# Altium schematic sheet manette_temp.SchDoc
size A4
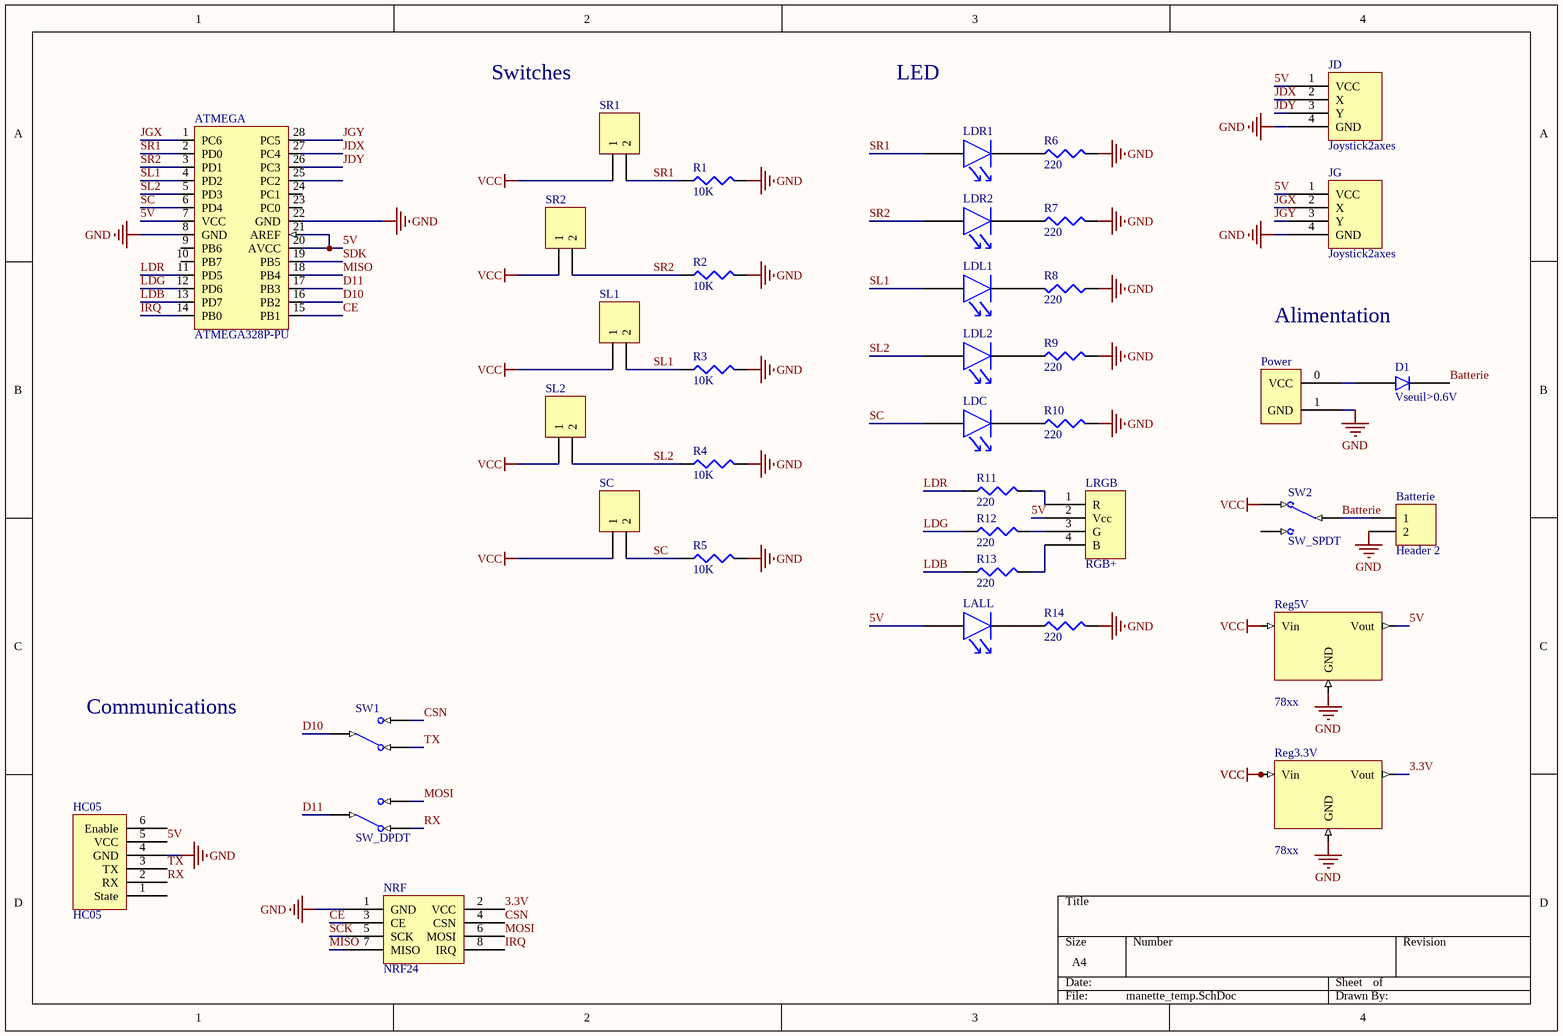
[diagram p0: manette_temp.SchDoc]

## Parts
ATMEGA  ATMEGA328P-PU  [DIP28_300]
Batterie  Header 2  [HDR1X2]
D1  Vseuil>0.6V  [SMA]
HC05  HC05  [HC05]
JD  Joystick2axes  [Joystick2axes]
JG  Joystick2axes  [Joystick2axes]
LALL  comment  [LED5]  (value not drawn)
LDC  comment  [LED0805]  (value not drawn)
LDL1  comment  [LED0805]  (value not drawn)
LDL2  comment  [LED0805]  (value not drawn)
LDR1  comment  [LED0805]  (value not drawn)
LDR2  comment  [LED0805]  (value not drawn)
LRGB  RGB+  [Led RGB]
NRF  NRF24  [NRF24]
Power  Connecteur Power  [Connecteur Power]  (value not drawn)
R1  value 10K  [0805]  (hidden comment: RES)
R2  value 10K  [0805]  (hidden comment: RES)
R3  value 10K  [0805]  (hidden comment: RES)
R4  value 10K  [0805]  (hidden comment: RES)
R5  value 10K  [0805]  (hidden comment: RES)
R6  value 220  [0805]  (hidden comment: RES)
R7  value 220  [0805]  (hidden comment: RES)
R8  value 220  [0805]  (hidden comment: RES)
R9  value 220  [0805]  (hidden comment: RES)
R10  value 220  [0805]  (hidden comment: RES)
R11  value 220  [0805]  (hidden comment: RES)
R12  value 220  [0805]  (hidden comment: RES)
R13  value 220  [0805]  (hidden comment: RES)
R14  value 220  [0805]  (hidden comment: RES)
Reg3.3V  78xx  [TO252]
Reg5V  78xx  [TO252]
SC  Header 2  [HDR1X2]  (value not drawn)
SL1  Header 2  [HDR1X2]  (value not drawn)
SL2  Header 2  [HDR1X2]  (value not drawn)
SR1  Header 2  [HDR1X2]  (value not drawn)
SR2  Header 2  [HDR1X2]  (value not drawn)
SW1  SW_DPDT  [dpdt_bascule]
SW2  SW_SPDT  [1K2_V]

## Nets
GND: ATMEGA.8(GND) ATMEGA.22(GND) Batterie.2 HC05.4(GND) JD.4(GND) JG.4(GND) NRF.1(GND) Power.1(GND) R1.2 R2.2 R3.2 R4.2 R5.2 R6.2 R7.2 R8.1 R9.2 R10.2 R14.2 Reg3.3V.2(GND) Reg5V.2(GND)
VCC: Reg3.3V.1(Vin) Reg5V.1(Vin) SC.1 SL1.1 SL2.1 SR1.1 SR2.1 SW2.2(A)
3.3V: NRF.2(VCC) Reg3.3V.3(Vout)
5V: ATMEGA.7(VCC) ATMEGA.20(AVCC) ATMEGA.21(AREF) HC05.5(VCC) JD.1(VCC) JG.1(VCC) LALL.A LRGB.2(Vcc) Reg5V.3(Vout)
Batterie: Batterie.1 D1.2 SW2.1
CE: ATMEGA.15(PB1) NRF.3(CE)
CSN: NRF.4(CSN) SW1.6(B)
D10: ATMEGA.16(PB2) SW1.4
D11: ATMEGA.17(PB3) SW1.1
IRQ: ATMEGA.14(PB0) NRF.8(IRQ)
JDX: ATMEGA.27(PC4) JD.2(X)
JDY: ATMEGA.26(PC3) JD.3(Y)
JGX: ATMEGA.1(PC6) JG.2(X)
JGY: ATMEGA.28(PC5) JG.3(Y)
LDB: ATMEGA.13(PD7) R13.1
LDG: ATMEGA.12(PD6) R12.1
LDR: ATMEGA.11(PD5) R11.1
MISO: ATMEGA.18(PB4) NRF.7(MISO)
MOSI: NRF.6(MOSI) SW1.3(B)
RX: HC05.2(RX) SW1.2(A)
SC: ATMEGA.6(PD4) LDC.A R5.1 SC.2
SCK: NRF.5(SCK)
SDK: ATMEGA.19(PB5)
SL1: ATMEGA.4(PD2) LDL1.A R3.1 SL1.2
SL2: ATMEGA.5(PD3) LDL2.A R4.1 SL2.2
SR1: ATMEGA.2(PD0) LDR1.A R1.1 SR1.2
SR2: ATMEGA.3(PD1) LDR2.A R2.1 SR2.2
TX: HC05.3(TX) SW1.5(A)
NetD1_1: D1.1 Power.0(VCC)
NetLALL_K: LALL.K R14.1
NetLDC_K: LDC.K R10.1
NetLDL1_K: LDL1.K R8.2
NetLDL2_K: LDL2.K R9.1
NetLDR1_K: LDR1.K R6.1
NetLDR2_K: LDR2.K R7.1
NetLRGB_1: LRGB.1(R) R11.2
NetLRGB_3: LRGB.3(G) R12.2
NetLRGB_4: LRGB.4(B) R13.2

Not connected (* = marked no-connect by the designer): ATMEGA 9(PB6) 10(PB7) 23(PC0) 24(PC1) 25(PC2); HC05 1(State) 6(Enable); SW2 3(B)

## Notes on the sheet
- Switches
- LED
- Alimentation
- Communications

## Library data of the parts
Batterie SC SL1 SL2 SR1 SR2 = Header 2: Header, 2-Pin; LatestRevisionDate: 17-Jul-2002; LatestRevisionNote: Re-released for DXP Platform.; Publisher: Altium Limited
D1 = DIODE: diode usage général
LALL LDC LDL1 LDL2 LDR1 LDR2 = LED: LED 5mm/3mm/CMS
R1-R14 = RES: resistance
Reg3.3V Reg5V = REG_POS: régulateur positif fixe